# Altium schematic sheet Driver_SW.SchDoc: Buck Sinc Converter
size A4; Organization: UDESC; Revision: R0; SheetNumber: 3; SheetTotal: 10
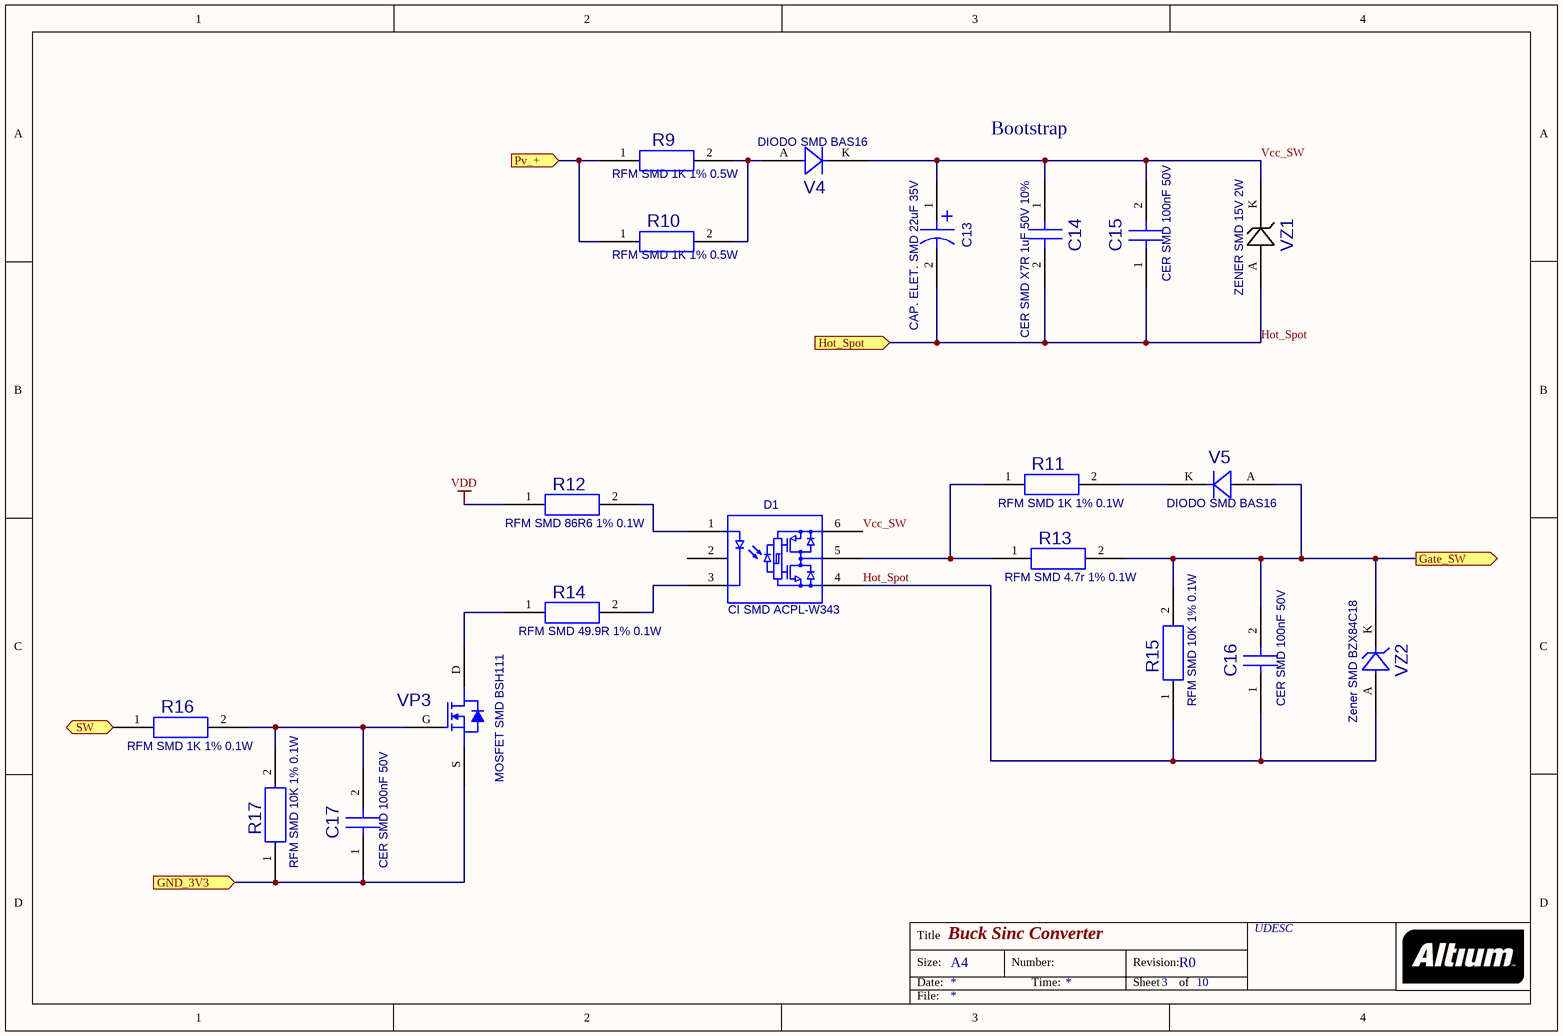
[diagram p0: Driver_SW.SchDoc]

## Parts
C13  value CAP. ELET. SMD 22uF 35V  [CAP UUD CR 5X5.8]  (hidden comment: 11690909)
C14  value CER SMD X7R 1uF 50V 10%  [C0805_R_V0]  (hidden comment: 11736520)
C15  value CER SMD 100nF 50V  [C0805_R_V0]  (hidden comment: 10192075)
C16  value CER SMD 100nF 50V  [C0805_R_V0]  (hidden comment: 10192075)
C17  value CER SMD 100nF 50V  [C0805_R_V0]  (hidden comment: 10192075)
D1  value CI SMD ACPL-W343  [SO-6 (11.5 MM)]  (hidden comment: 12544475)
R9  value RFM SMD 1K 1% 0.5W  [R2010A]  (hidden comment: 10191999)
R10  value RFM SMD 1K 1% 0.5W  [R2010A]  (hidden comment: 10191999)
R11  value RFM SMD 1K 1% 0.1W  [R0805_R_V0]  (hidden comment: 10118077)
R12  value RFM SMD 86R6 1% 0.1W  [R0805_R_V0]  (hidden comment: 10192050)
R13  value RFM SMD 4.7r 1% 0.1W  [R0805_R_V0]  (hidden comment: 10192015)
R14  value RFM SMD 49.9R 1% 0.1W  [R0805_R_V0]  (hidden comment: 10192035)
R15  value RFM SMD 10K 1% 0.1W  [R0805_R_V0]  (hidden comment: 10118076)
R16  value RFM SMD 1K 1% 0.1W  [R0805_R_V0]  (hidden comment: 10118077)
R17  value RFM SMD 10K 1% 0.1W  [R0805_R_V0]  (hidden comment: 10118076)
V4  value DIODO SMD BAS16  [SOT23A]  (hidden comment: 10261302)
V5  value DIODO SMD BAS16  [SOT23A]  (hidden comment: 10261302)
VP3  value MOSFET SMD BSH111  [MOS_SOT23A]  (hidden comment: 11110327)
VZ1  value ZENER SMD 15V 2W  [DO-214AC_12665621(Primary)]  (hidden comment: 12665621)
VZ2  value Zener SMD BZX84C18  [ZEN_SOT23A]  (hidden comment: 10050447)

## Ports
Gate_SW (out), GND_3V3 (in), Hot_Spot (in), Pv_+ (in), SW (in)

## Nets
VDD: R12.1
Gate_SW: C16.2 R13.2 R15.2 V5.A VZ2.K ; port Gate_SW
GND_3V3: C17.1 R17.1 VP3.S ; port GND_3V3
Hot_Spot: C13.2 C14.2 C15.1 C16.1 D1.4(VEE) R15.1 VZ1.A VZ2.A ; port Hot_Spot
Pv_+: R9.1 R10.1 ; port Pv_+
SW: R16.1 ; port SW
Vcc_SW: C13.1 C14.1 C15.2 D1.6(VCC) V4.K VZ1.K
NetC17_2: C17.2 R16.2 R17.2 VP3.G
NetD1_1: D1.1(A) R12.2
NetD1_3: D1.3(K) R14.2
NetD1_5: D1.5(VOUT) R11.1 R13.1
NetR9_2: R9.2 R10.2 V4.A
NetR11_2: R11.2 V5.K
NetR14_1: R14.1 VP3.D

Not connected (* = marked no-connect by the designer): D1 2; V4 NC; V5 NC; VZ2 NC

## Notes on the sheet
- Bootstrap
- Title
- Size:
- Date:
- A4
- Number:
- Time:
- Revision:
- Sheet
- of
- File:

## Library data of the parts
C13 = 11690909: CAP. ELET. SMD 22uF 35V; HISsym: Atualizado em 20/12/05; TOL: 20%; HISitem: Criado em 02/03/11 (p/ Osnir); Altura: 5,8mm; PN: 11690909; PMT: SMD; ComponenteLink1URL: *
C14 = 11736520: CER SMD X7R 1uF 50V 10%; HISsym: Atualizado em 12/07/05; HISitem: Criado em 15/04/11 (p/ Sandro W.); PN: 11736520; PMT: SMD
C15-C17 = 10192075: CER SMD 100nF 50V; HISsym: Atualizado em 12/07/05; TOL: 10%; ITEM BAAN: 0333.0044; PN: 10192075; PMT: SMD
D1 = 12544475: CI SMD ACPL-W343; HISitem: Criado em 04/04/13 (p/ Geovani); PN: 12544475; PMT: SMD; ComponentLink1URL: http://www.avagotech.com/docs/AV02-2928EN
R9 R10 = 10191999: RFM SMD 1K 1% 0.5W; HISsym: Atualizado em 20/07/05; PN: 10191999; PMT: SMD
R11 R16 = 10118077: RFM SMD 1K 1% 0.1W; HISsym: Atualizado em 20/07/05; PN: 10118077; PMT: SMD
R12 = 10118077: RFM SMD 86R6 1% 0.1W; HISsym: Atualizado em 20/07/05; PN: 10192050; PMT: SMD
R13 = 10118077: RFM SMD 4.7r 1% 0.1W; HISsym: Atualizado em 20/07/05; PN: 10192015; PMT: SMD
R14 = 10118077: RFM SMD 49.9R 1% 0.1W; HISsym: Atualizado em 20/07/05; PN: 10192035; PMT: SMD
R15 R17 = 10118077: RFM SMD 10K 1% 0.1W; HISsym: Atualizado em 20/07/05; PN: 10118076; PMT: SMD
V4 V5 = 10261302: DIODO SMD BAS16; HISsym: Atualizado em 17/04/06; VAL: 200mA; PN: 10261302; PMT: SMD
VP3 = 11110327: MOSFET SMD BSH111; HISsym: Atualizado em 12/09/05; HISitem: Criado em 20/12/07 (p/ Ricardo); PN: 11110327; PMT: SMD
VZ1 = 12665621: ZENER SMD 15V 2W; HISsym: Atualizado em 11/07/06; HISitem: Criado em 13/12/13 (p/ Sandro W.); PN: 12665621; PMT: SMD
VZ2 = 10050447: Zener  SMD BZX84C18; HISsym: Atualizado em 11/07/06; NUMBER PIN: 03; PN: 10050447; PMT: SMD